# EAGLE design circuit (EAGLE 6.5.0)
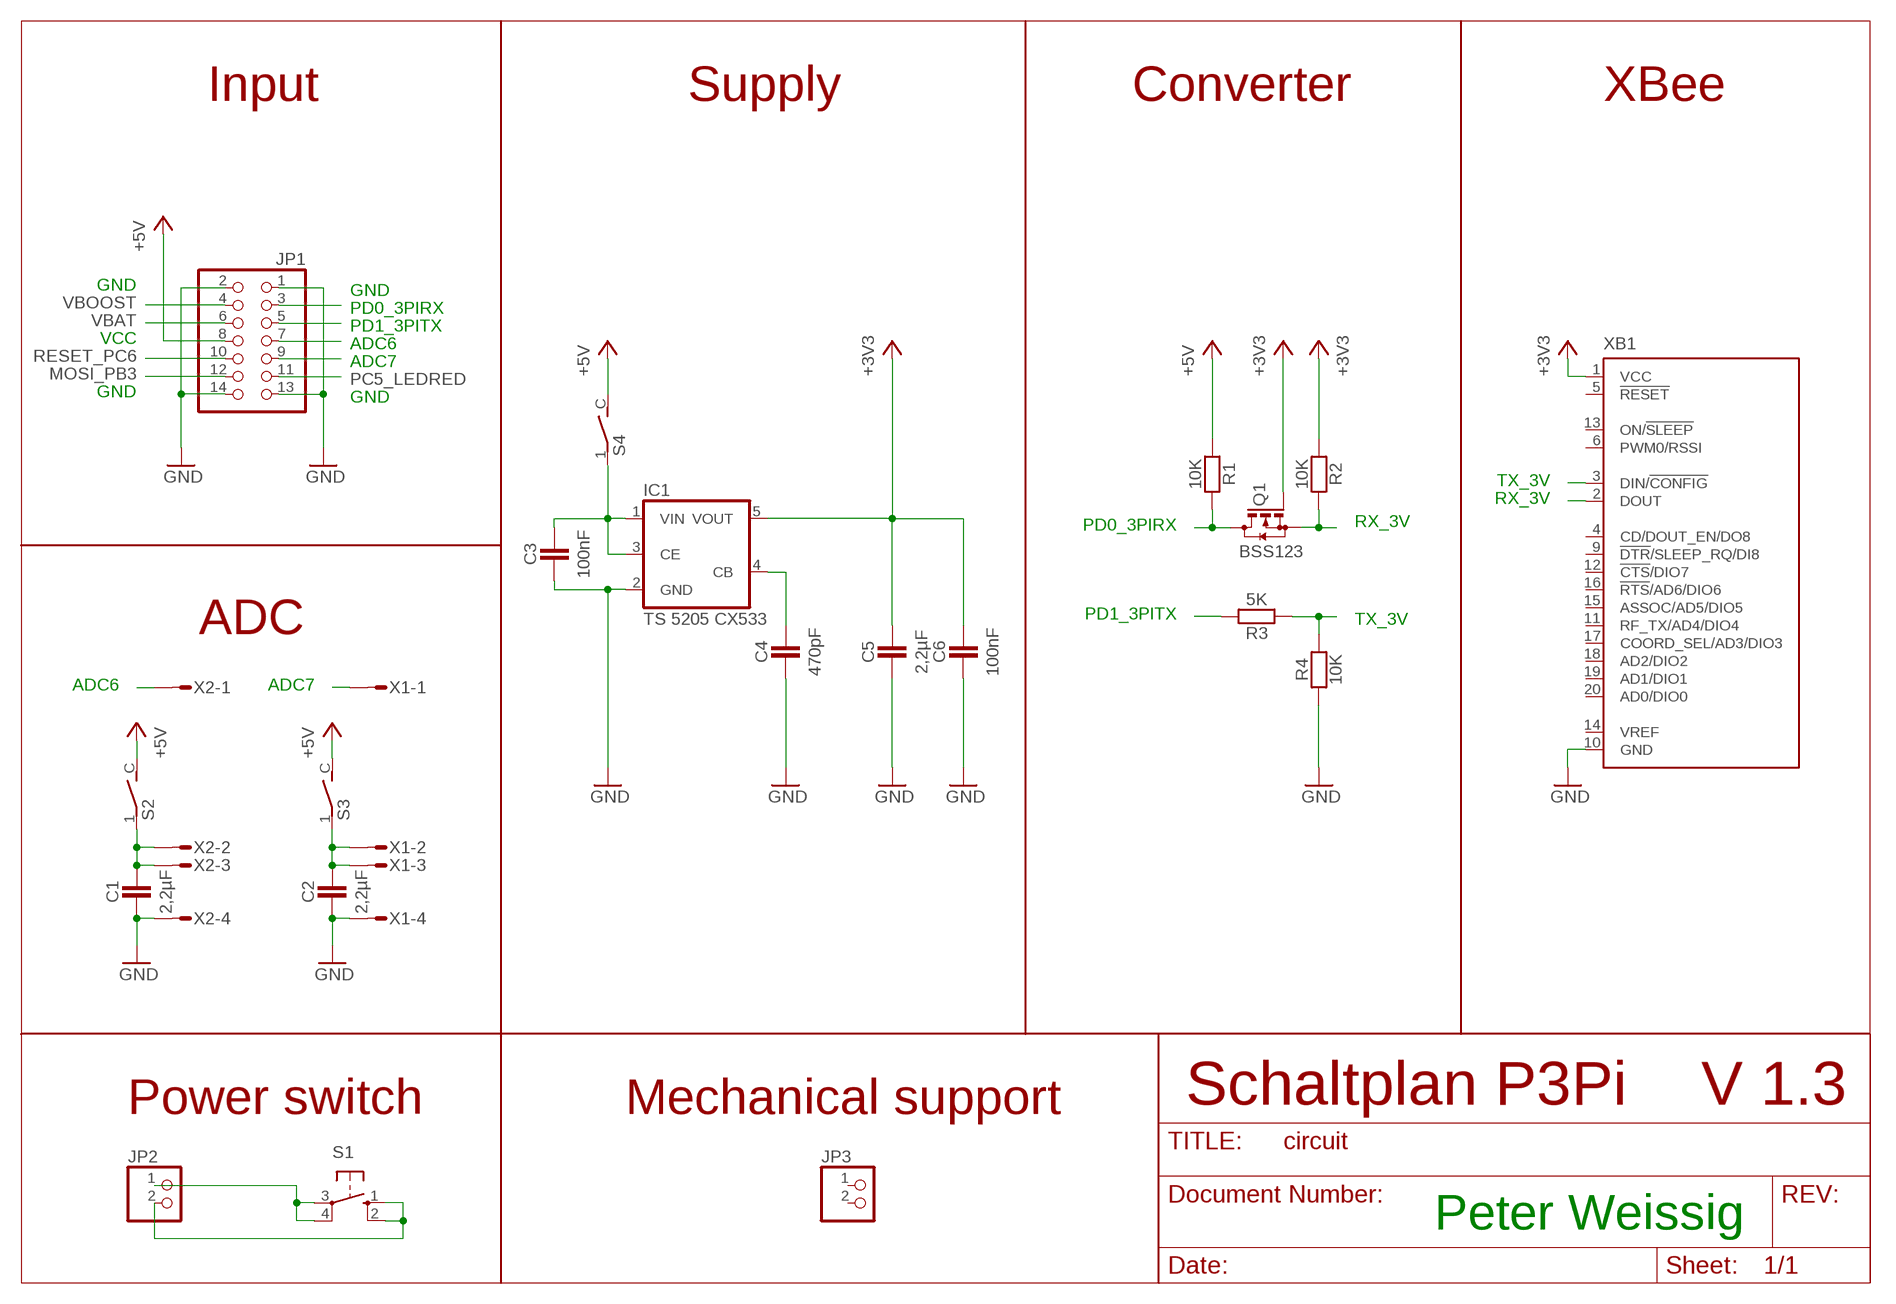
[diagram p0: schematic, sheet 1]

## Parts
C1  2,2µF  CAPACITATOR-1206  [SMD_1206]
C2  2,2µF  CAPACITATOR-1206  [SMD_1206]
C3  100nF  CAPACITATOR-1206  [SMD_1206]
C4  470pF  CAPACITATOR-1206  [SMD_1206]
C5  2,2µF  CAPACITATOR-1206  [SMD_1206]
C6  100nF  CAPACITATOR-1206  [SMD_1206]
IC1  TS 5205 CX533  TS520533  [SOT25]
JP1  PINHD-2X7  [2X07]
JP2  PINHD-1X2  [1X02]
JP3  PINHD-1X2  [1X02]
Q1  BSS123  [SOT23]
R1  10K  RESISTOR-1206  [SMD_1206]
R2  10K  RESISTOR-1206  [SMD_1206]
R3  5K  RESISTOR-1206  [SMD_1206]
R4  10K  RESISTOR-1206  [SMD_1206]
S1  TASTER  [TASTER_SMD]
S2  SCHALTER  [SCHALTER_SMD]
S3  SCHALTER  [SCHALTER_SMD]
S4  SCHALTER  [SCHALTER_SMD]
X1  STECKER_MICROMATCH_4SMD  [STECKER_MICROMATCH_4SMD]
X2  STECKER_MICROMATCH_4SMD  [STECKER_MICROMATCH_4SMD]
XB1  XBEESMD  [FUNK_XBEE_SMD]

## Nets
+3V3: C5.1 C6.1 IC1.5(VOUT) Q1.1(G) R2.2 XB1.1(VCC)
ADC6: JP1.7 X2.1
ADC7: JP1.9 X1.1
GND: C1.2 C2.2 C3.2 C4.2 C5.2 C6.2 IC1.2(GND) JP1.1 JP1.2 JP1.13 JP1.14 R4.2 X1.4 X2.4 XB1.10(GND)
MOSI_PB3: JP1.12
N$1: C4.1 IC1.4(CB)
N$16: JP2.1 S1.3(P) S1.4(P1)
N$17: JP2.2 S1.1(S) S1.2(S1)
PC5_LEDRED: JP1.11
PD0_3PIRX: JP1.3 Q1.3(D) R1.1
PD1_3PITX: JP1.5 R3.1
RESET_PC6: JP1.10
RX_3V: Q1.2(S) R2.1 XB1.2(DOUT)
TX_3V: R3.2 R4.1 XB1.3(DIN/!CONFIG)
VBAT: JP1.6
VBOOST: JP1.4
VCC: JP1.8 R1.2 S2.C S3.C S4.C ; supply symbol labelled +5V
VCC_ADC6: C1.1 S2.1 X2.2 X2.3
VCC_ADC7: C2.1 S3.1 X1.2 X1.3
VCC_XBEE: C3.1 IC1.1(VIN) IC1.3(CE) S4.1
Unconnected: JP3.1 JP3.2 XB1.4(CD/DOUT_EN/DO8) XB1.5(!RESET) XB1.6(PWM0/RSSI) XB1.9(!DTR!/SLEEP_RQ/DI8) XB1.11(RF_TX/AD4/DIO4) XB1.12(!CTS!/DIO7) XB1.13(ON/!SLEEP) XB1.14(VREF) XB1.15(ASSOC/AD5/DIO5) XB1.16(!RTS!/AD6/DIO6) XB1.17(COORD_SEL/AD3/DIO3) XB1.18(AD2/DIO2) XB1.19(AD1/DIO1) XB1.20(AD0/DIO0)

## Notes on the sheet
- Input | Supply | Converter | XBee
- ADC
- Power switch | Mechanical support | Schaltplan P3Pi | V 1.3
- Peter Weissig

## Library data of the parts
C1-C6 = robo_ag:CAPACITATOR: Kondensator
IC1 = v-reg:TS5205: 150mA Low Noise LDO Voltage Regulator with Enable TSC [Taiwan Semiconductor Company, Ltd] Source: http://www.taiwansemi.com .. 5205_0409c.pdf
JP1 = pinhead:PINHD-2X7: PIN HEADER
JP2 JP3 = pinhead:PINHD-1X2: PIN HEADER
Q1 = transistor-small-signal:BSS123: N-CHANNEL MOS FET
R1-R4 = robo_ag:RESISTOR: Widerstand
S1 = robo_ag:TASTER: Kurzhubtaster
S2-S4 = robo_ag:SCHALTER: Schalter
X1 X2 = robo_ag:STECKER_MICROMATCH_4: MicroMaTch 4 7-215464-4 / 0-215464-4 Drawing Number C-215464 DDEController.pdf
XB1 = robo_ag:XBEE: XBee (TM) /XBee-PRO(TM) OEM RF Modules Source: MaxStream, Inc. xbee_productmanual.pdf

## Board
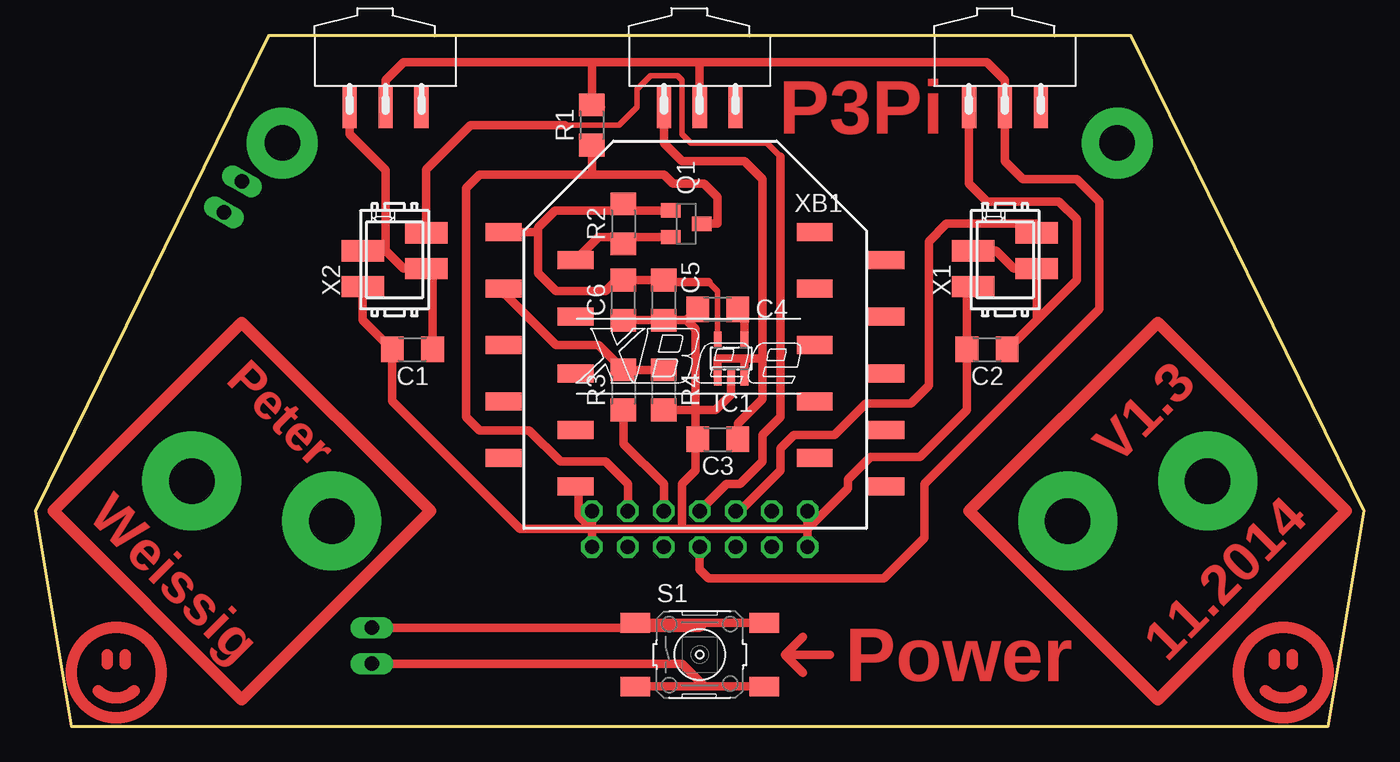
[diagram p1: board, top side]
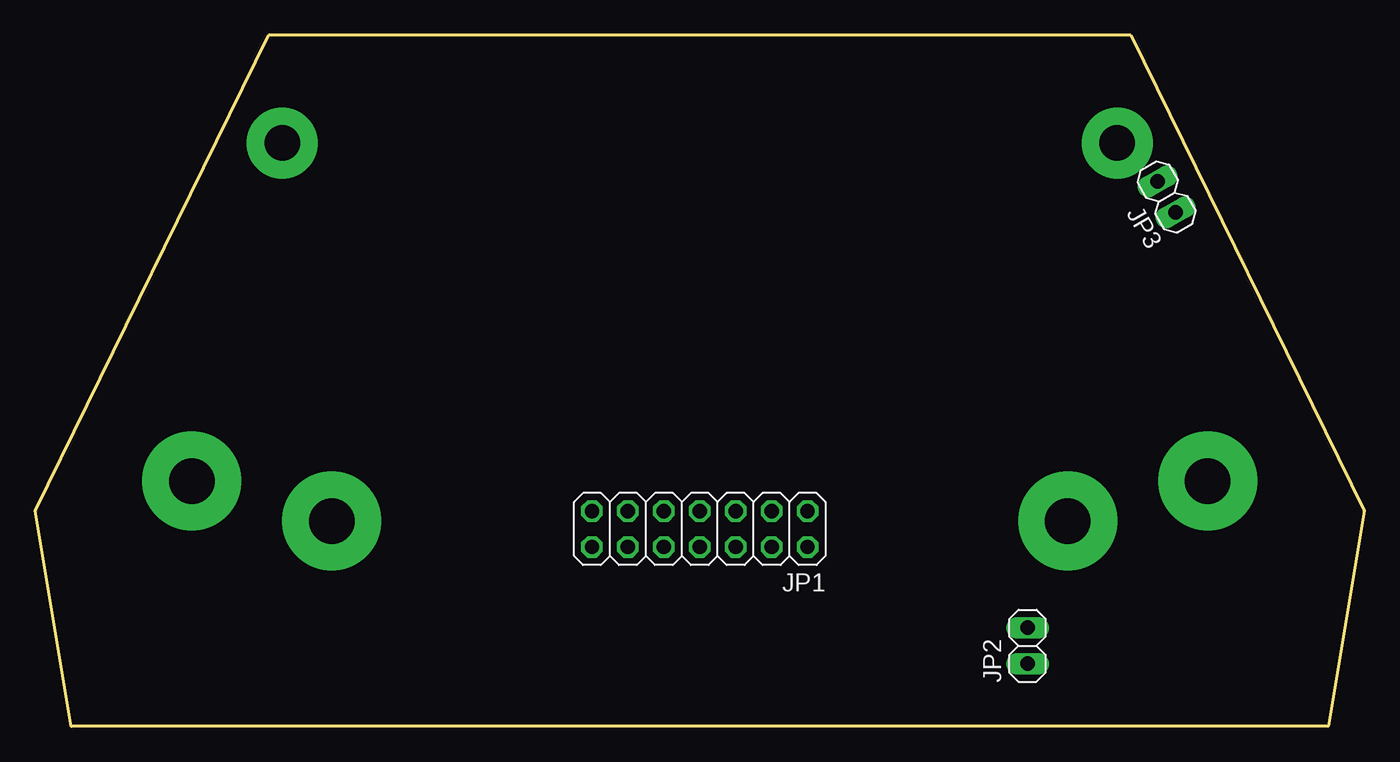
[diagram p2: board, bottom side, seen from below]

Size 93.98 x 48.89 mm. Coordinates in mm from the lower left corner, seen from the top.
Outline: 16.51,48.89 77.47,48.89 93.98,15.24 91.44,0 2.54,0 0,15.24 16.51,48.89
Copper layers (1*16): Top 0.035mm / dielectric 1.5mm / Bottom 0.035mm
Design rules "default": minimum track width 10mil, minimum drill 24mil, track to track 8mil, track to pad 8mil, pad to pad 8mil, via to via 8mil, smd to smd 8mil, copper to edge 40mil, drill to drill 8mil, minimum pad ring 10mil, minimum via ring 8mil, stop-mask expansion 4mil, vias tented up to drill 0mil, thermal gap 10mil

### Footprints (pad centres in the part's own frame; a part is rotated, then mirrored left to right if it is on the bottom)
SMD_1206 = smd 1.6 x 1.803: 1 -1.422,0; 2 1.422,0
SOT25 = smd 0.55 x 1.2: 1 -0.95,-1.3; 2 0,-1.3; 3 0.95,-1.3; 4 0.95,1.3; 5 -0.95,1.3
2X07 = drill 1.016 octagon: 1 -7.62,-1.27; 2 -7.62,1.27; 3 -5.08,-1.27; 4 -5.08,1.27; 5 -2.54,-1.27; 6 -2.54,1.27; 7 0,-1.27; 8 0,1.27; 9 2.54,-1.27; 10 2.54,1.27; 11 5.08,-1.27; 12 5.08,1.27; 13 7.62,-1.27; 14 7.62,1.27
1X02 = drill 1.016 long: 1 -1.27,0; 2 1.27,0
SOT23 = smd 1 x 1.4: 1 -0.95,-1.1; 2 0.95,-1.1; 3 0,1.1
TASTER_SMD = smd 2.1 x 1.4: 1 -4.55,2.25; 2 4.55,2.25; 3 -4.55,-2.25; 4 4.55,-2.25
SCHALTER_SMD = smd 1 x 3: 1 -2.54,0; 2 2.54,0; C 0,0
STECKER_MICROMATCH_4SMD = smd 1.5 x 3: 1 1.905,-2.25; 2 0.635,2.25; 3 -0.635,-2.25; 4 -1.905,2.25
FUNK_XBEE_SMD = smd 2.54 x 1.27: 1 -13.54,9; 2 -8.46,7; 3 -13.54,5; 4 -8.46,3; 5 -13.54,1; 6 -8.46,-1; 7 -13.54,-3; 8 -8.46,-5; 9 -13.54,-7; 10 -8.46,-9; 11 13.54,-9; 12 8.46,-7; 13 13.54,-5; 14 8.46,-3; 15 13.54,-1; 16 8.46,1; 17 13.54,3; 18 8.46,5; 19 13.54,7; 20 8.46,9

### Placement (x,y rotation side)
C1  26.67,26.67 180 top
C2  67.31,26.67 180 top
C3  48.26,20.32 180 top
C4  48.26,29.53 180 top
C5  44.45,30.16 270 top
C6  41.59,30.16 270 top
IC1  49.21,26.04 0 top
JP1  46.99,13.97 180 bottom
JP2  23.81,5.71 90 bottom
JP3  13.97,37.47 120 bottom
Q1  46.04,35.56 270 top
R1  39.37,42.55 90 top
R2  41.59,35.56 90 top
R3  41.59,23.81 90 top
R4  44.45,23.81 270 top
S1  46.99,5.08 0 top
S2  24.77,43.81 0 top
S3  68.58,43.81 0 top
S4  46.99,43.81 0 top
X1  68.58,33.02 90 top
X2  25.4,33.02 90 top
XB1  46.66,25.99 0 top

### Tracks (layer width: path | path; a pad name or v marks a point on that pad's centre or on a via)
+3V3
  Top 0.406: IC1.5 48.26,30.79 47.62,31.43
  Top 0.61: 35.56,34.98 35.56,32.07 36.83,30.8 40.32,30.8 41.11,31.58 C6.1 C5.1 44.6,31.43 47.62,31.43 | Q1.1 41.59,36.51 | 41.59,36.51 36.77,36.51 35.56,35.3 35.56,34.98 | XB1.1 35.56,34.98 | 41.59,36.51 R2.2
ADC6
  Top 0.406: 37.46,42.55 41.27,42.55 42.54,43.81 42.54,45.08 43.5,46.04 45.4,46.04 45.72,45.72 45.72,41.91 46.35,41.28 51.75,41.28 52.7,40.32
  Top 0.61: 52.7,40.32 52.7,21.91 51.43,20.64 51.43,18.73 49.85,17.14 48.89,17.14 JP1.7 | X2.1 27.65,39.4 30.8,42.55 37.46,42.55
ADC7
  Top 0.61: X1.1 70.83,35.56 64.45,35.56 63.18,34.29 63.18,24.13 61.91,22.86 58.74,22.86 56.52,20.64 53.66,20.64 52.7,19.68 52.7,18.1 49.85,15.24 JP1.9
GND
  Top 0.61: 46.67,22.39 R4.2 46.51,22.39 46.67,22.22 | 46.67,22.39 48.11,22.39 49.21,23.5 IC1.2 | C4.2 46.05,28.74 | 46.05,28.74 C5.2 C6.2 | 46.05,28.74 46.67,28.12 46.67,22.39 | XB1.10 38.42,16.98 38.42,14.92 39.37,13.97 | 39.37,13.97 45.72,13.97 | 45.72,13.97 54.61,13.97 | 46.67,22.39 46.67,22.22 | 46.67,22.22 46.67,20.32 | C3.2 46.67,20.32 | 54.61,13.97 57.47,16.83 57.47,17.46 59.05,19.05 62.55,19.05 65.89,22.39 C2.2 65.89,30.67 X1.4 | 46.67,20.32 46.67,18.1 45.72,17.14 45.72,13.97 | JP1.1 39.37,13.97 | JP1.2 39.37,13.97 | JP1.13 54.61,13.97 | JP1.14 54.61,13.97 | 39.37,13.97 34.29,13.97 25.25,23.01 C1.2 23.15,28.77 X2.4
N$1
  Top 0.61: IC1.4 50.16,29.05 C4.1
N$4  (via drill 3.2 pad 7)
  other vias: 11.07,17.36
N$5  (via drill 3.2 pad 7)
  other vias: 20.97,14.53
N$8  (via drill 3.2 pad 7)
  other vias: 82.91,17.36
N$9  (via drill 3.2 pad 7)
  other vias: 73.01,14.53
N$10
  Top 0.813: 14.6,28.57 27.94,15.24 14.6,1.9 1.27,15.24 14.6,28.57
N$13  (via drill 2.5 pad 5)
  other vias: 76.52,41.28
N$14  (via drill 2.5 pad 5)
  other vias: 17.46,41.28
N$15
  Top 0.813: 66.04,15.24 79.38,1.9 92.71,15.24 79.38,28.57 66.04,15.24
N$16
  Top 0.61: JP2.1 45.72,4.45 47.34,2.83 | S1.4 47.34,2.83 | S1.3 47.34,2.83
N$17
  Top 0.61: JP2.2 46.99,6.98 47.34,7.33 | S1.2 47.34,7.33 | S1.1 47.34,7.33
N$18
  Top 0.813: 87.63,5.08 87.63,4.45
N$19
  Top 0.813: 88.9,5.08 88.9,4.45
N$20
  Top 0.813: 87,2.54 arc90 89.53,2.54
N$21
  Top 0.813: 5.08,5.08 5.08,4.45
N$22
  Top 0.61: 53.02,5.08 56.2,5.08 | 53.02,5.08 54.29,6.35 | 53.02,5.08 54.29,3.81
N$23
  Top 0.813: 6.35,5.08 6.35,4.45
N$24
  Top 0.813: 4.45,2.54 arc90 6.98,2.54
PD0_3PIRX
  Top 0.61: Q1.3 48.26,35.56 48.26,37.47 47.31,38.42 45.09,38.42 44.45,39.05 39.37,39.05 | 39.37,39.05 31.43,39.05 30.48,38.1 30.48,21.91 31.43,20.95 34.92,20.95 37.15,18.73 40.32,18.73 41.91,17.14 JP1.3 | R1.1 39.37,39.05
PD1_3PITX
  Top 0.61: R3.1 41.59,20 44.45,17.14 JP1.5
RX_3V
  Top 0.61: Q1.2 41.59,34.61 | 41.59,34.61 39.83,34.61 XB1.2 | R2.1 41.59,34.61
  Top 0.813: XB1.2 38.2,33.02
TX_3V
  Top 0.61: R4.1 R3.2 39.84,26.99 36.83,26.99 33.12,30.69
  Top 0.813: XB1.3 33.12,30.69
VCC
  Top 0.61: JP1.8 46.99,11.11 47.62,10.48 60.01,10.48 62.86,13.34 62.86,17.14 75.25,29.53 75.25,37.15 73.66,38.73 69.85,38.73 68.58,40 S3.C 68.58,45.72 67.31,46.99 46.99,46.99 | R1.2 39.85,43.97 | 39.85,43.97 40,43.81 | 46.99,46.99 39.37,46.99 | 39.37,46.99 26.04,46.99 24.77,45.72 S2.C | S4.C 46.99,46.99 | 39.85,43.97 39.37,44.45 39.37,46.99
VCC_ADC6
  Top 0.61: X2.2 24.77,33.66 | 24.77,33.66 26.04,32.39 X2.3 28.09,31.94 C1.1 | 24.77,33.66 24.77,39.37 22.23,41.91 S2.1
VCC_ADC7
  Top 0.61: X1.2 67.94,33.66 69.22,32.39 X1.3 70.83,28.77 | C2.1 70.83,28.77 | 70.83,28.77 73.66,31.6 73.66,35.88 72.39,37.15 67.31,37.15 66.04,38.42 S3.1
VCC_XBEE
  Top 0.61: C3.1 49.68,21.42 51.43,23.18 51.43,26.04 | 51.43,26.04 51.43,38.73 50.16,40 45.72,40 44.45,41.28 S4.1 | IC1.1 48.26,26.03 48.26,26.04 50.16,26.04 | 50.16,26.04 IC1.3 50.16,26.03 50.16,26.04 | 50.16,26.04 51.43,26.04
(copper drawn outside any net)
  shapes: Top circle x2

### Text on the board
Top: P3Pi | Peter | V1.3 | Weissig | 11.2014 | Power
Document: Winkel 1a | Winkel 1b | Sharp Re | Sharp Li